# EasyEDA Pro project ProPrj_minibal.epro

# Schematic miniball
Board Name: miniball; Create Date: 2024-09-15; Page Name: P1; Project Name: miniball; Schematic Name: miniball; Update Date: 2024-09-29; Company: 嘉立创EDA; Page Size: A4; Version: V1.0
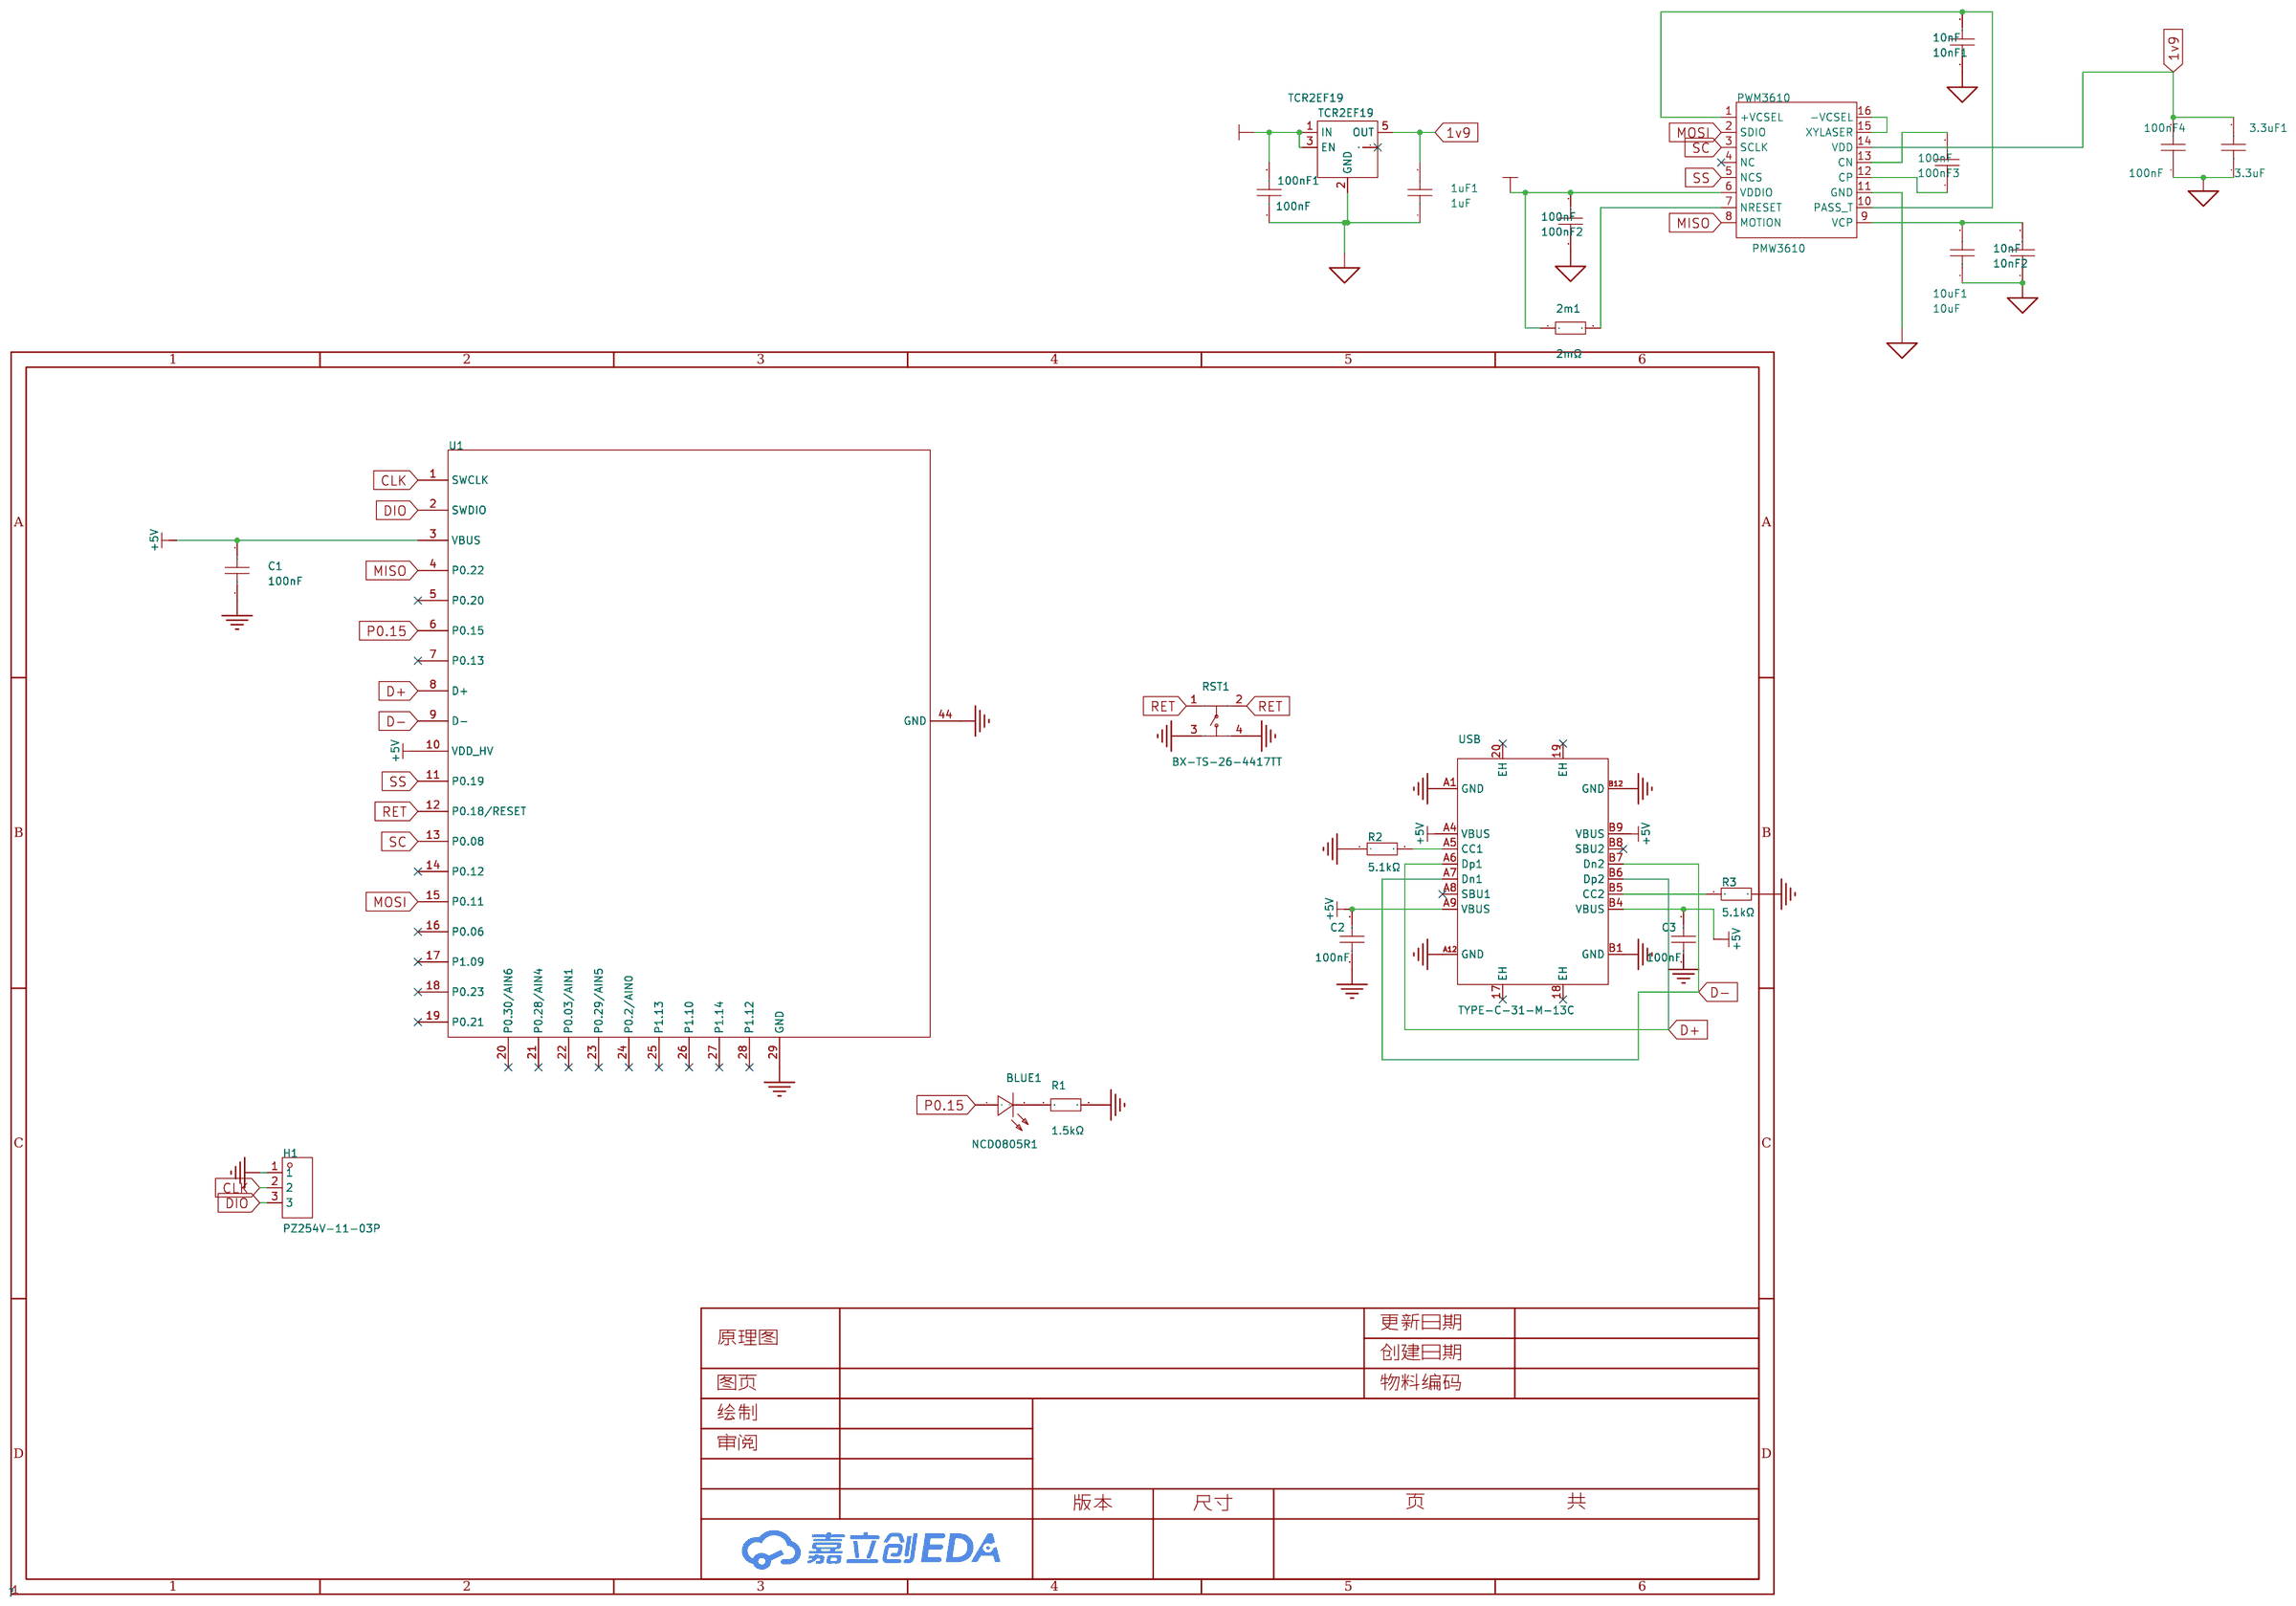
[diagram p0: schematic sheet]

## Parts
1uF1  1uF  [c0805]
2m1  2mΩ  [R0805]
3.3uF1  3.3uF  [c0805]
10nF1  10nF  [c0805]
10nF2  10nF  [c0805]
10uF1  10uF  [c0805]
100nF1  100nF  [c0805]
100nF2  100nF  [c0805]
100nF3  100nF  [c0805]
100nF4  100nF  [c0805]
BLUE1  NCD0805R1  [LED0805-R-RD]
C1  100nF  [C1206]
C2  100nF  [C0603]
C3  100nF  [C0603]
H1  PZ254V-11-03P  [HDR-TH_3P-P2.54-V-M]
PWM3610  PMW3610  [mylib:PMW3610]
R1  1.5kΩ  [R1206]
R2  5.1kΩ  [R0805]
R3  5.1kΩ  [R0805]
RST1  BX-TS-26-4417TT  [SW-SMD_4P-L5.2-W5.2-P3.70-LS6.5]
TCR2EF19  TCR2EF19  [Package_TO_SOT_SMD:SOT-23-5]
U1  N52840  [52840MICRO-v1]
USB  TYPE-C-31-M-13C  [USB-C-SMD_TYPE-C-31-M-13C]

## Library data of the parts
1uF1 = CL21B105KBFNNNE: 容值:1uF;精度:±10%;额定电压:50V;材质(温度系数):X7R;; LCSC Part Name: 1uF ±10% 50V; Supplier Part: C28323; Manufacturer: SAMSUNG(三星); Supplier Footprint: 0805; JLCPCB Part Class: Basic Part; Datasheet: https://atta.szlcsc.com/upload/public/pdf/source/20160218/1457707763339.pdf; Supplier: LCSC; Tolerance: ±10%; Voltage Rated: 50V; Temperature Coefficient: X7R
2m1 = RLM10FTSMR002: 阻值:2mΩ;精度:±1%;功率:500mW;温度系数:±50ppm/℃;; LCSC Part Name: 2mΩ ±1% 500mW; Supplier Part: C163090; Manufacturer: 大毅科技; Supplier Footprint: 0805; JLCPCB Part Class: Extended Part; Datasheet: https://atta.szlcsc.com/upload/public/pdf/source/20190621/C393099_0FB28B25F89EBDFD36A063D527AB5378.pdf; Supplier: LCSC; Tolerance: ±1%; Power(Watts): 500mW; Temperature Coefficient: ±50ppm/℃
3.3uF1 = 0805B335K160NT: 容值:3.3uF;精度:±10%;额定电压:16V;材质(温度系数):X7R;; LCSC Part Name: 3.3uF ±10% 16V; Supplier Part: C38332; Manufacturer: FH(风华); Supplier Footprint: 0805; JLCPCB Part Class: Extended Part; Datasheet: https://atta.szlcsc.com/upload/public/pdf/source/20200305/C486355_26A10D38EF8C2A5C37091D0039909270.pdf; Supplier: LCSC; Tolerance: ±10%; Voltage Rated: 16V; Temperature Coefficient: X7R
10nF1 10nF2 = CC0805KRX7R9BB103: 容值:10nF;精度:±10%;额定电压:50V;材质(温度系数):X7R;; LCSC Part Name: 10nF ±10% 50V; Supplier Part: C83170; Manufacturer: YAGEO(国巨); Supplier Footprint: 0805; JLCPCB Part Class: Extended Part; Datasheet: https://atta.szlcsc.com/upload/public/pdf/source/20170211/1486785656773.pdf; Supplier: LCSC; Tolerance: ±10%; Voltage Rated: 50V; Temperature Coefficient: X7R
10uF1 = CL21A106KOQNNNE: 容值:10uF;精度:±10%;额定电压:16V;材质(温度系数):X5R;; LCSC Part Name: 10uF ±10% 16V; Supplier Part: C1713; Manufacturer: SAMSUNG(三星); Supplier Footprint: 0805; JLCPCB Part Class: Extended Part; Datasheet: https://atta.szlcsc.com/upload/public/pdf/source/20160218/1457707763339.pdf; Supplier: LCSC; Tolerance: ±10%; Voltage Rated: 16V; Temperature Coefficient: X5R
100nF1-100nF4 = 0805B104K500NT: 容值:100nF;精度:±10%;额定电压:50V;材质(温度系数):X7R;; LCSC Part Name: 100nF ±10% 50V; Supplier Part: C38141; Manufacturer: FH(风华); Supplier Footprint: 0805; JLCPCB Part Class: Extended Part; Datasheet: https://atta.szlcsc.com/upload/public/pdf/source/20200305/C486355_26A10D38EF8C2A5C37091D0039909270.pdf; Supplier: LCSC; Tolerance: ±10%; Voltage Rated: 50V; Temperature Coefficient: X7R
BLUE1 = NCD0805R1: 灯头类型:-;发光颜色:红色;正向电压(VF):1.6V~2.6V;功率:65mW;正向电流:20mA;主波长:615nm~630nm;二极管配置:独立二极管;透镜颜色:无色透明透镜;色温:-;发光强度:67mcd~195mcd;发光角度:130°;载带方式:-;工作温度:-30℃~+85℃;; Supplier Part: C84256; Manufacturer: 国星光电; Supplier Footprint: 0805; JLCPCB Part Class: 基础库; Datasheet: https://atta.szlcsc.com/upload/public/pdf/source/20200820/C84256_F0A75A43B3EAD75808600A0514C76B99.pdf; Supplier: LCSC; Emitted Color: 红色; Forward Voltage (VF): 1.6V~2.6V; Power Dissipation: 65mW; Forward Current: 20mA; Dominant Wavelength: 615nm~630nm; Diode Configuration: 独立二极管; Lens Color: 无色透明透镜; Luminous Intensity: 67mcd~195mcd; Viewing Angle: 130°; Operating Temperature: -30℃~+85℃
C1 = CC0603KRX7R9BB104: 容值:100nF;精度:±10%;额定电压:50V;材质(温度系数):X7R;; LCSC Part Name: 100nF ±10% 50V; Supplier Part: C14663; Manufacturer: YAGEO(国巨); Supplier Footprint: 0603; JLCPCB Part Class: Basic Part; Datasheet: https://atta.szlcsc.com/upload/public/pdf/source/20180910/C282072_33301C7F631E79921B82A8DAC6BCC5B3.pdf; Supplier: LCSC; Tolerance: ±10%; Voltage Rated: 50V; Temperature Coefficient: X7R
C2 C3 = CAP_0603: Supplier Footprint: 0603
H1 = PZ254V-11-03P: 插针结构:1x3P;间距:2.54mm;行距:-;圆针/方针:方针;安装类型:直插;排数:单排;总PIN位数:3P;额定电流:3A;额定电压:250V;配合针长度:6mm;塑高:2.5mm;端接针长度:3mm;工作温度范围:-40℃~+105℃;颜色:黑色;; LCSC Part Name: 间距:2.54mm 1x3P 直插 方针; Supplier Part: C2937625; Manufacturer: XFCN(兴飞); Supplier Footprint: 插件,P=2.54mm; JLCPCB Part Class: Extended Part; Datasheet: https://atta.szlcsc.com/upload/public/pdf/source/20200309/C492402_8335C3D49C4E4C618838D59BB1D024C1.pdf; Supplier: LCSC; Pin Structure: 1x3P; Pitch: 2.54mm; Circluar Pins/Square Pins: 方针; Mounting Type: 直插; Number of Rows: 单排; Number of Pins: 3P; Current Rating (Max): 3A; Voltage Rating (Max): 250V; Length of Mating Pin: 6mm; Insulation Height: 2.5mm; Length of End Connection Pin: 3mm; Operating Temperature Range: -40℃~+105℃; Color: 黑色
PWM3610 = mysymbol_PMW3610
R1 = 0805W8F1501T5E: 电阻类型:厚膜电阻;阻值:1.5kΩ;精度:±1%;功率:125mW;最大工作电压:150V;温度系数:±100ppm/℃;; LCSC Part Name: 1.5kΩ ±1% 125mW 厚膜电阻; Supplier Part: C4310; Manufacturer: UNI-ROYAL(厚声); Supplier Footprint: 0805; JLCPCB Part Class: 基础库; Datasheet: https://atta.szlcsc.com/upload/public/pdf/source/20200306/C422600_1E6D84923E4A46A82E41ADD87F860B5C.pdf; Supplier: LCSC; Type: 厚膜电阻; Tolerance: ±1%; Power(Watts): 125mW; Overload Voltage (Max): 150V; Temperature Coefficient: ±100ppm/℃; Operating Temperature Range: -55℃~+155℃
R2 R3 = 0805W8F5101T5E: 电阻类型:厚膜电阻;阻值:5.1kΩ;精度:±1%;功率:125mW;最大工作电压:150V;温度系数:±100ppm/℃;; LCSC Part Name: 5.1kΩ ±1% 125mW 厚膜电阻; Supplier Part: C27834; Manufacturer: UNI-ROYAL(厚声); Supplier Footprint: 0805; JLCPCB Part Class: 基础库; Datasheet: https://atta.szlcsc.com/upload/public/pdf/source/20200306/C422600_1E6D84923E4A46A82E41ADD87F860B5C.pdf; Supplier: LCSC; Type: 厚膜电阻; Tolerance: ±1%; Power(Watts): 125mW; Overload Voltage (Max): 150V; Temperature Coefficient: ±100ppm/℃; Operating Temperature Range: -55℃~+155℃
RST1 = BX-TS-26-4417TT: 电路结构:单刀单掷;按钮形状:圆形按钮;作用力:260gf;安装方式:立贴;开关长度:4mm;开关宽度:4mm;开关高度:1.7mm;带支架:不带;触点电流:50mA;额定电压(AC):250V;额定电压(DC):12V;绝缘电阻:100MΩ;机械寿命:10万次;; LCSC Part Name: 4x4x1.7铜头开关; Supplier Part: C18078110; Manufacturer: Bossie(博锡); Supplier Footprint: SMD-4P,4x4mm; Datasheet: https://atta.szlcsc.com/upload/public/pdf/source/20231017/916BF7A8DB1936A62562F9A253B59526.pdf; Supplier: LCSC; Circuit: 单刀单掷; Actuator Style: 圆形按钮; Operating Force: 260gf; Mounting Style: 立贴; Switch Length: 4mm; Switch Width: 4mm; Switch Height: 1.7mm; Strike Gundam: 不带; Contact Current: 50mA; Voltage Rating (AC): 250V; Voltage Rating (DC): 12V; Insulation Resistance: 100MΩ; Actuator/Cap Color: 金色; Pin Style: 鸥翼型; Mechanical Life: 10万次; Operating Temperature: -30℃~+80℃
TCR2EF19 = Regulator_Linear_TLV70218_SOT23-5: LCSC: C146366
U1 = 52840micro_v1
USB = TYPE-C-31-M-13C: 连接器类型:Type-C;标准:-;公母:母;端口数量:1;触点数量:16P;安装方式:沉板;额定电流 - 电源:5A;工作温度范围:-30℃~+80℃;; LCSC Part Name: Type-C 母 沉板; Supplier Part: C2848620; Manufacturer: 韩国韩荣; Supplier Footprint: SMD; JLCPCB Part Class: 扩展库; Datasheet: https://atta.szlcsc.com/upload/public/pdf/source/20210810/4CCDF598433BF097AC090909194D2506.pdf; Supplier: LCSC; Connector Type: Type-C; Gender: 母; Number of Ports: 1; Number of Contacts: 16P; Mounting Style: 沉板; Current Rating - Power (Max): 5A; Operating Temperature Range: -30℃~+80℃

## Nets
1v9: 1uF1.2 3.3uF1.2 100nF4.2 PWM3610.14(VDD) TCR2EF19.5(OUT)
+5V: C1.2 C2.2 C3.2 U1.3(VBUS) U1.10(VDD_HV) USB.A4(VBUS) USB.A9(VBUS) USB.B4(VBUS) USB.B9(VBUS)
GND: 1uF1.1 3.3uF1.1 10nF1.1 10nF2.1 10uF1.1 100nF1.1 100nF2.1 100nF4.1 C1.1 C2.1 C3.1 H1.1 PWM3610.11(GND) R1.2 R2.1 R3.2 RST1.3 RST1.4 TCR2EF19.2(GND) U1.29(GND) U1.44(GND) USB.A1(GND) USB.A12(GND) USB.B1(GND) USB.B12(GND)
VCC_EXT: 2m1.1 100nF1.2 100nF2.2 PWM3610.6(VDDIO) TCR2EF19.1(IN) TCR2EF19.3(EN)
CLK: H1.2 U1.1(SWCLK)
D+: U1.8(D+) USB.A6(Dp1) USB.B6(Dp2)
D-: U1.9(D-) USB.A7(Dn1) USB.B7(Dn2)
DIO: H1.3 U1.2(SWDIO)
MISO: PWM3610.8(MOTION) U1.4(P0.22)
MOSI: PWM3610.2(SDIO) U1.15(P0.11)
P0.15: BLUE1.1(+) U1.6(P0.15)
RET: RST1.1 RST1.2 U1.12(P0.18/RESET)
SC: PWM3610.3(SCLK) U1.13(P0.08)
SS: PWM3610.5(NCS) U1.11(P0.19)
$1N774: BLUE1.2(-) R1.1
$1N1429: 2m1.2 PWM3610.7(NRESET)
$1N1432: 10nF2.2 10uF1.2 PWM3610.9(VCP)
$1N1434: 10nF1.2 PWM3610.1(+VCSEL) PWM3610.10(PASS_T)
$1N1436: PWM3610.15(XYLASER) PWM3610.16(-VCSEL)
$1N1437: 100nF3.2 PWM3610.13(CN)
$1N1438: 100nF3.1 PWM3610.12(CP)
$1N2733: R3.1 USB.B5(CC2)
$1N2744: R2.2 USB.A5(CC1)

Not connected (* = marked no-connect by the designer): PWM3610 4(NC)*; TCR2EF19 4(NC)*; U1 5(P0.20)* 7(P0.13)* 14(P0.12)* 16(P0.06)* 17(P1.09)* 18(P0.23)* 19(P0.21)* 20(P0.30/AIN6)* 21(P0.28/AIN4)* 22(P0.03/AIN1)* 23(P0.29/AIN5)* 24(P0.2/AIN0)* 25(P1.13)* 26(P1.10)* 27(P1.14)* 28(P1.12)*; USB 17(EH)* 18(EH)* 19(EH)* 20(EH)* A8(SBU1)* B8(SBU2)*

# Board miniball
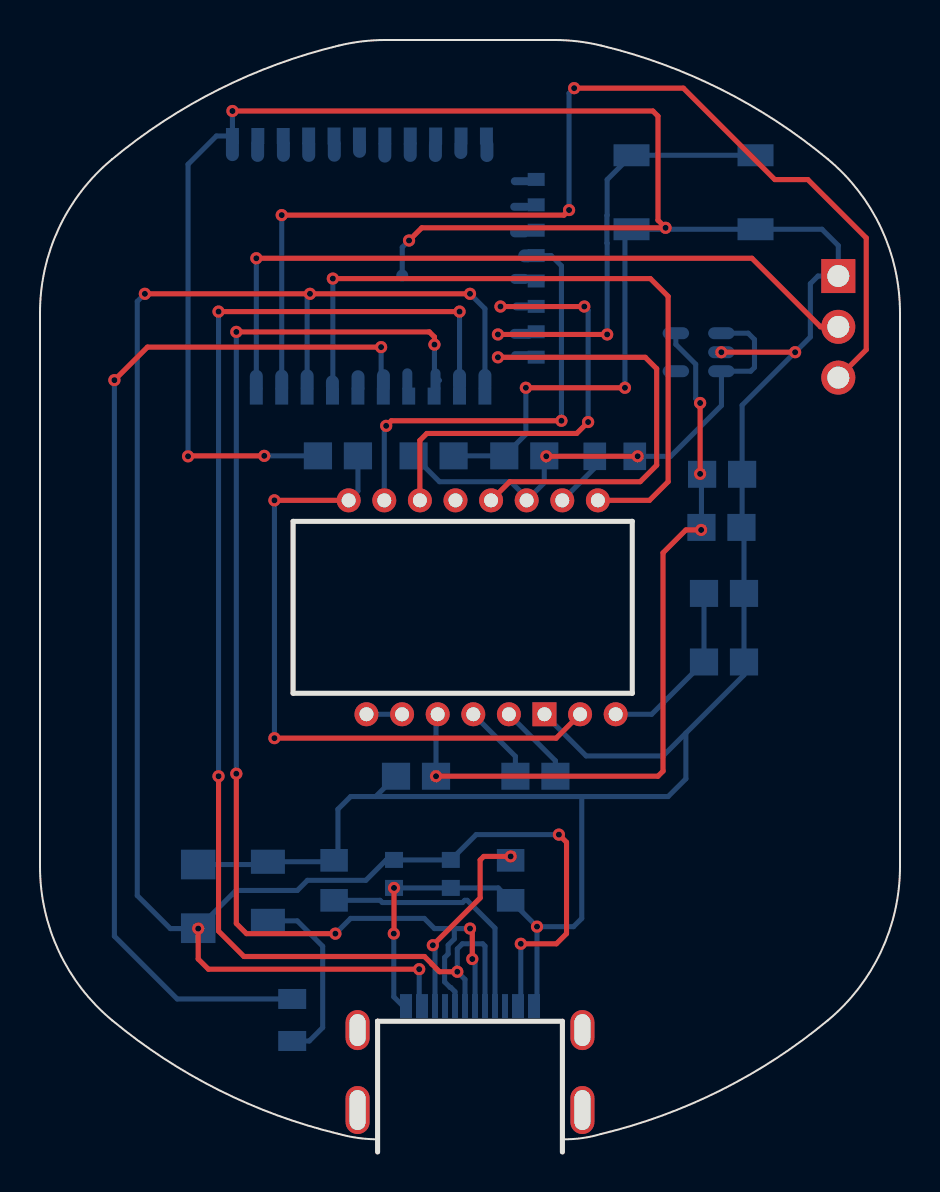
[diagram p1: board, top side]
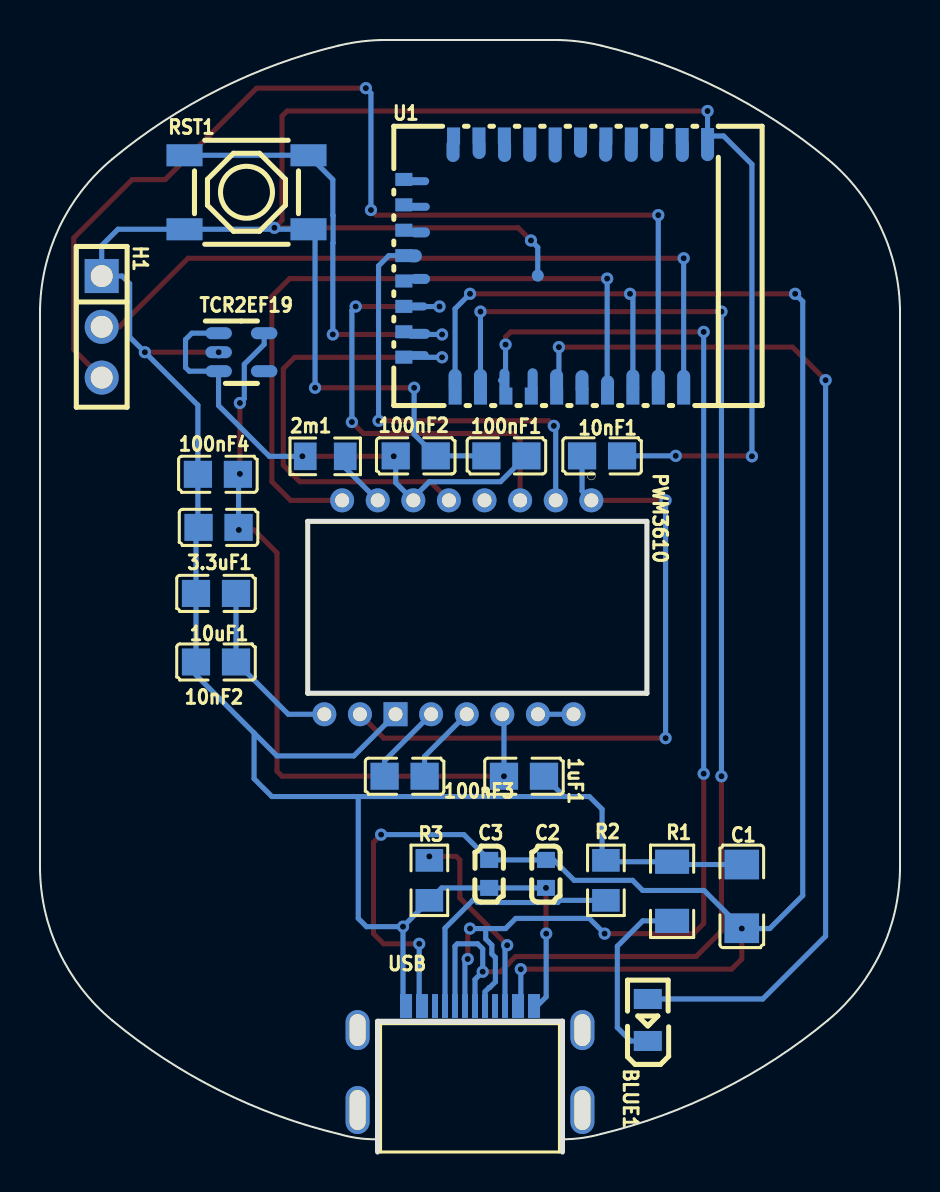
[diagram p2: board, bottom side, seen from below]

Outline 43 x 55.62 mm; copper layers: Top Layer, Bottom Layer. Coordinates in mm from the lower left corner of the outline.
Outline path: 16.93,0.64 arc(15.93,0.7) 14.95,0.9 arc(8.95,3.09) 3.61,6.58 arc(0.95,10.03) 0,14.28 0,41.97 arc(0.95,46.22) 3.61,49.66 arc(8.95,53.15) 14.95,55.35 arc(16.11,55.55) 17.29,55.62 25.71,55.62 arc(26.89,55.55) 28.05,55.35 arc(34.05,53.15) 39.39,49.66 arc(42.05,46.22) 43,41.97 43,14.28 arc(42.05,10.03) 39.39,6.58 arc(34.05,3.09) 28.05,0.9 arc(27.14,0.7) 26.2,0.64
Stack: Top Layer 0.035mm / Dielectric1 1.51mm FR4 er 4.5 / Bottom Layer 0.035mm

## Design rules (mm)
template: 自定义配置
spacing copperThickness1oz: track to track 0.102, other pairs 0.152 to 0.3
spacing customer_rule (default): track to track 0.203, other pairs 0.203 to 0.203
track width copperThickness1oz: min 0.127, default 0.254, max 2.54
track width copperThickness2oz: min 0.203, default 0.254, max 2.54
track width custom_style (default): min 0.254, default 0.254, max 0.762
track width vcc_gnd: min 0.254, default 0.762, max 0.762
differential pair differentialPair (default): width min 0.127, default 0.254, max 2.54; gap min 0.152, default 0.152
via viaSize (default): diameter min 0.5, default 0.61, max 10; hole min 0.3, default 0.305, max 6.299
net 1V9 uses vcc_gnd
net GND uses vcc_gnd
net VCC_EXT uses vcc_gnd
net +5V uses vcc_gnd

## Placement (name value [footprint] x y rotation side)
1uF1  1uF  [c0805]  18.8 18.8 0 bottom
2m1  2mΩ  [R0805]  28.74 34.8 180 bottom
3.3uF1  3.3uF  [c0805]  34.07 31.24 180 bottom
10nF1  10nF  [c0805]  14.9 34.82 0 bottom
10nF2  10nF  [c0805]  34.2 24.51 180 bottom
10uF1  10uF  [c0805]  34.2 27.94 180 bottom
100nF1  100nF  [c0805]  19.68 34.82 180 bottom
100nF2  100nF  [c0805]  24.21 34.82 0 bottom
100nF3  100nF  [c0805]  24.77 18.8 180 bottom
100nF4  100nF  [c0805]  34.11 33.9 180 bottom
BLUE1  NCD0805R1  [LED0805-R-RD]  12.61 6.61 90 bottom
C1  100nF  [C1206]  7.91 12.79 270 bottom
C2  100nF  [C0603]  17.7 13.91 90 bottom
C3  100nF  [C0603]  20.54 13.91 90 bottom
H1  PZ254V-11-03P  [HDR-TH_3P-P2.54-V-M]  39.91 41.28 270 bottom
PWM3610  PMW3610  [mylib:PMW3610]  15.43 32.6 270 bottom
R1  1.5kΩ  [R1206]  11.4 13.04 90 bottom
R2  5.1kΩ  [R0805]  14.7 13.59 270 bottom
R3  5.1kΩ  [R0805]  23.53 13.59 270 bottom
RST1  BX-TS-26-4417TT  [SW-SMD_4P-L5.2-W5.2-P3.70-LS6.5]  32.68 48.01 180 bottom
TCR2EF19  TCR2EF19  [Package_TO_SOT_SMD:SOT-23-5]  32.93 40.01 180 bottom
U1  N52840  [52840MICRO-v1]  25.31 37.47 180 bottom
USB  TYPE-C-31-M-13C  [USB-C-SMD_TYPE-C-31-M-13C]  21.5 4.7 180 bottom

## Footprints (pads in the part's own frame, mm; a bottom-side part is the same pattern mirrored in y, then rotated)
52840MICRO-v1
  oval 0.65x1.2 smd: 1(14.493,1.065) 2(13.223,1.07) 3(11.954,1.085) 5(9.409,1.04) 6(8.139,1.095) 9(4.333,1.109) 10(3.063,1.109) 19(2.963,12.655) 21(5.538,12.655) 22(6.798,12.66) 23(8.069,12.625) 25(10.594,12.67) 26(11.873,12.66) 27(13.139,12.665) 28(14.428,12.66) 29(15.688,12.7)
  rect 0.65x0.85 smd: 1(14.495,0.346) 2(13.225,0.346) 3(11.955,0.346) 4(10.685,0.346) 5(9.415,0.346) 6(8.145,0.346) 7(6.875,0.346) 8(5.605,0.346) 9(4.335,0.346) 10(3.065,0.346) 19(2.988,13.355) 20(4.258,13.355) 21(5.528,13.355) 22(6.798,13.355) 23(8.068,13.355) 24(9.338,13.355) 25(10.608,13.355) 26(11.878,13.355)
  oval 0.65x0.9 smd: 4(10.688,0.934)
  oval 0.5x1.2 smd: 7(6.944,1.135) 8(5.534,1.13)
  rect 0.85x0.65 smd: 11(0.501,2.293) 12(0.501,3.563) 13(0.501,4.833) 14(0.501,6.103) 15(0.501,7.373) 16(0.501,8.643) 17(0.501,9.913) 18(0.501,11.183)
  oval 1x0.4 smd: 11(1.248,2.394) 17(1.298,9.815) 18(1.268,11.095)
  oval 1.2x0.5 smd: 12(1.228,3.459)
  oval 0.9x0.4 smd: 13(1.239,4.83)
  oval 1x0.5 smd: 14(1.308,6.205) 16(1.308,8.534)
  oval 0.8x0.65 smd: 15(1.004,7.359)
  oval 0.65x1 smd: 20(4.269,12.705) 24(9.334,12.765)
  rect 0.65x0.8 smd: 27(13.148,13.355) 28(14.418,13.355) 29(15.688,13.355)
  round 0.6 smd: 44(7.199,6.375)
C0603
  rect 0.8x0.9 smd: 1(-0.7,0) 2(0.7,0)
c0805
  rect 1.41x1.35 smd: 1(-1,0) 2(1,0)
C1206
  rect 1.485x1.728 smd: 1(-1.593,0) 2(1.593,0)
HDR-TH_3P-P2.54-V-M
  rect 1.7x1.7 hole 1.1: 1(-2.54,0)
  round 1.7 hole 1.1: 2(0,0) 3(2.54,0)
LED0805-R-RD
  rect 1x1.399 smd: 1(1.05,0) 2(-1.05,0)
mylib:PMW3610
  round 1.2 hole 0.7: 1(0,0) 2(0,-1.78) 3(0,-3.56) 4(0,-5.34) 5(0,-7.12) 6(0,-8.9) 7(0,-10.68) 8(0,-12.46) 9(10.7,-13.35) 10(10.7,-11.57) 12(10.7,-8.01) 13(10.7,-6.23) 14(10.7,-4.45) 15(10.7,-2.67) 16(10.7,-0.89)
  rect 1.2x1.2 hole 0.7: 11(10.7,-9.79)
Package_TO_SOT_SMD:SOT-23-5
  rrect 1.325x0.6 smd: 1(-1.137,0.95) 2(-1.137,0) 3(-1.137,-0.95) 4(1.137,-0.95) 5(1.137,0.95)
R0805
  rect 1.133x1.377 smd: 1(-1,0) 2(1,0)
R1206
  rect 1.208x1.701 smd: 1(-1.479,0) 2(1.479,0)
SW-SMD_4P-L5.2-W5.2-P3.70-LS6.5
  rect 1.8x1.1 smd: 1(-3.1,1.85) 2(3.1,1.85) 3(-3.1,-1.85) 4(3.1,-1.85)
USB-C-SMD_TYPE-C-31-M-13C
  oval 1.2x2 hole 0.8x1.6: 17(5.62,1.4) 20(-5.62,1.4)
  oval 1.2x2.4 hole 0.8x2: 18(5.62,-2.6) 19(-5.62,-2.6)
  rect 0.3x1.2 smd: A1(-3.35,2.6) A4(-2.55,2.6) A5(-1.25,2.6) A6(-0.25,2.6) A7(0.25,2.6) A8(1.25,2.6) A9(2.55,2.6) A12(3.35,2.6) B1(3.05,2.6) B4(2.25,2.6) B5(1.75,2.6) B6(0.75,2.6) B7(-0.75,2.6) B8(-1.75,2.6) B9(-2.25,2.6) B12(-3.05,2.6)

## Nets
As in the schematic, except:
1V9: 1uF1.2 3.3uF1.2 100nF4.2 PWM3610.14 TCR2EF19.5

Pads without a net: PWM3610 4; TCR2EF19 4; U1 5 7 14 16 17 18 19 20 21 22 23 24 25 26 27 28; USB 17 18 19 20 A8 B8

## Via types
v1: diameter 0.61, hole 0.305, Top Layer to Bottom Layer, 54 vias

## Routing (per net, layer and track width the routed paths; a pad name or vN(x,y) marks a point on that pad's centre or on a via; arc(x,y) is an arc through that point)
1V9: length 38.2
  Top Layer w0.254: v1(19.8,18.8) 30.9,18.8 31.15,19.05 31.15,29.97 32.29,31.12 v1(33.06,31.12) ; v1(33.01,33.92) v1(33.01,37.47)
  Bottom Layer w0.254: 100nF4.2 33.07,33.87 3.3uF1.2 33.07,31.13 v1(33.06,31.12) ; v1(33.01,37.47) 32.78,37.69 32.78,39.41 31.79,40.4 TCR2EF19.5 ; PWM3610.14 19.8,21.81 v1(19.8,18.8)
+5V: length 105.3
  Top Layer w0.254: v1(5.24,42.93) v1(13.5,42.93) v1(21.5,42.93) ; v1(24.04,10.42) 25.82,10.42 26.33,10.92 26.33,15.5 v1(25.94,15.88) ; v1(7.91,11.18) 7.91,9.65 8.42,9.14 v1(18.96,9.14)
  Bottom Layer w0.254: v1(5.24,42.93) 4.86,42.55 4.86,12.83 6.51,11.18 7.89,11.18 C1.2 ; v1(21.5,42.93) 22.25,42.18 U1.10 ; USB.B4 USB.A9 18.96,7.31 v1(18.96,9.14) ; v1(13.5,42.93) 13.36,42.78 U1.3 ; C1.2 v1(7.91,11.18) ; C1.2 9.8,13.08 12.86,13.08 13.37,13.59 16.29,13.59 17.31,14.61 C2.2 C3.2 21.81,15.88 v1(25.94,15.88) ; v1(24.04,10.42) 24.04,7.31 24.05,7.3 USB.B9
GND: length 196.1
  Top Layer w0.254: v1(18.45,45.59) 19.09,46.23 v1(31.28,46.23) 30.9,46.61 30.9,51.82 30.64,52.07 v1(9.62,52.07) ; v1(24.29,38.23) v1(29.25,38.23) ; v1(11.21,34.82) 7.43,34.82 v1(7.4,34.8) ; v1(17.7,13.21) 17.7,10.93 v1(17.69,10.92) ; v1(34.07,40.01) v1(37.76,40.01)
  Bottom Layer w0.254: v1(24.85,11.27) USB.A1 24.55,7.3 ; v1(24.85,11.27) 26.67,11.27 27.09,11.69 27.09,17.77 27.1,17.78 ; v1(24.85,11.27) R3.2 22.91,13.21 C3.1 v1(17.7,13.21) ; v1(29.25,38.23) 29.25,45.83 RST1.4 RST1.3 39.1,46.16 39.91,45.34 H1.1 38.9,43.82 38.52,43.44 38.52,40.77 v1(37.76,40.01) 35.11,37.36 100nF4.1 35.11,31.28 3.3uF1.1 35.2,31.12 10uF1.1 10nF2.1 35.2,23.86 32.29,20.96 ; v1(9.62,52.07) 9.62,50.82 8.82,50.82 7.4,49.4 v1(7.4,34.8) ; v1(17.69,10.92) 17.69,7.76 18.15,7.3 USB.B1 ; 32.29,20.96 32.29,18.67 31.41,17.78 27.1,17.78 ; 32.29,20.96 31.15,19.81 27.31,19.81 PWM3610.11 ; 16.78,17.78 15.53,17.78 14.9,17.15 14.9,14.78 R2.1 14.63,14.52 R1.2 11.26,14.38 C1.1 ; 16.78,17.78 27.1,17.78 ; 16.78,17.78 1uF1.1 ; U1.44 18.11,45.25 v1(18.45,45.59) ; 10nF1.1 v1(11.21,34.82) ; 100nF1.1 100nF2.1 24.29,35.9 v1(24.29,38.23)
VCC_EXT: length 25.8
  Top Layer w0.254: v1(25.31,34.8) v1(29.88,34.8)
  Bottom Layer w0.254: 29.88,34.8 31.53,34.8 34.07,37.34 34.07,39.05 TCR2EF19.3 35.54,39.06 35.72,39.24 35.72,40.64 35.41,40.96 TCR2EF19.1 ; 29.88,34.8 2m1.1 ; 29.88,34.8 v1(29.88,34.8) ; 100nF1.2 19.97,33.53 23.53,33.53 24.33,32.73 PWM3610.6 25.21,33.48 100nF2.2
CLK: length 36.7
  Top Layer w0.254: v1(10.82,44.7) 35.6,44.7 39.03,41.28 H1.2
  Bottom Layer w0.254: U1.1 v1(10.82,44.7)
D+: length 62.5
  Top Layer w0.254: v1(9.82,41.02) 19.47,41.02 19.72,40.77 v1(19.72,40.39) ; v1(9.82,18.92) 9.82,11.43 10.32,10.92 v1(14.77,10.92) ; v1(21.5,11.18) 21.61,11.06 v1(21.61,9.65)
  Bottom Layer w0.254: 20.72,11.18 20.72,10.66 20.41,10.35 20.41,9.91 20.23,9.73 20.23,8.51 20.51,8.23 20.54,8.23 20.75,8.02 USB.B6 ; 20.72,11.18 19.72,11.18 19.21,11.69 15.53,11.69 v1(14.77,10.92) ; 20.72,11.18 v1(21.5,11.18) ; v1(9.82,18.92) v1(9.82,41.02) ; v1(19.72,40.39) 19.72,38.85 19.98,38.6 ; USB.A6 21.75,7.3 21.75,9.65
D-: length 66.8
  Top Layer w0.254: v1(20.86,9.02) 19.98,9.02 19.59,9.4 19.59,9.41 19.22,9.78 10.2,9.78 8.93,11.05 v1(8.93,18.8) ; v1(20.98,42.04) v1(8.93,42.04)
  Bottom Layer w0.254: USB.A7 21.25,8.63 v1(20.86,9.02) 20.86,10.16 21.12,10.42 22.13,10.42 22.25,10.3 USB.B7 ; v1(8.93,42.04) v1(8.93,18.8) ; U1.9 v1(20.98,42.04)
DIO: length 54.3
  Top Layer w0.254: 39.91,38.74 41.31,40.13 41.31,45.72 38.39,48.64 36.74,48.64 32.17,53.21 v1(26.71,53.21) ; v1(26.45,47.12) 26.2,46.86 v1(12.09,46.86)
  Bottom Layer w0.254: v1(26.71,53.21) 26.45,52.96 v1(26.45,47.12) ; U1.2 v1(12.09,46.86)
MISO: length 35.6
  Top Layer w0.254: 27.89,32.6 30.47,32.6 31.41,33.53 31.41,42.8 30.52,43.69 v1(14.64,43.69)
  Bottom Layer w0.254: U1.4 14.64,38.42 v1(14.64,43.69)
MOSI: length 21.9
  Top Layer w0.254: v1(17.31,36.32) 17.56,36.58 v1(26.07,36.58)
  Bottom Layer w0.254: v1(17.31,36.32) 17.21,36.23 PWM3610.2 ; U1.15 25.56,44.84 26.07,44.32 v1(26.07,36.58)
P0.15: length 53.8
  Top Layer w0.254: v1(3.72,38.61) 5.37,40.26 v1(17.05,40.26)
  Bottom Layer w0.254: v1(17.05,40.26) 17.05,38.68 U1.6 ; BLUE1.1 6.86,7.66 3.72,10.8 v1(3.72,38.61)
RET: length 23.1
  Top Layer w0.254: v1(22.9,40.89) v1(28.36,40.89)
  Bottom Layer w0.254: v1(28.36,40.89) 28.36,45.46 28.35,45.47 28.35,46.84 28.36,46.86 28.36,48.64 RST1.2 RST1.1 ; v1(22.9,40.89) 24.67,40.89 U1.12
SC: length 22.9
  Top Layer w0.254: v1(27.41,36.51) 26.83,35.94 19.34,35.94 18.99,35.59 PWM3610.3 ; v1(27.22,42.29) v1(23.02,42.29)
  Bottom Layer w0.254: v1(27.22,42.29) 27.41,42.1 v1(27.41,36.51) ; U1.13 24.07,42.29 v1(23.02,42.29)
SS: length 23.9
  Top Layer w0.254: v1(22.9,39.75) 30.26,39.75 30.83,39.18 30.83,34.35 30.01,33.53 23.49,33.53 PWM3610.5
  Bottom Layer w0.254: v1(22.9,39.75) 24.8,39.75 U1.11
$1N774: length 9.1
  Bottom Layer w0.254: R1.1 12.86,11.56 14.13,10.29 14.13,6.22 13.46,5.55 BLUE1.2
$1N1429: length 2.9
  Bottom Layer w0.254: 2m1.2 27.74,34.22 PWM3610.7
$1N1432: length 8.9
  Bottom Layer w0.254: PWM3610.9 30.58,21.9 10nF2.2 10uF1.2
$1N1434: length 33.8
  Top Layer w0.254: PWM3610.10 25.81,20.7 v1(11.72,20.7) ; PWM3610.1 v1(11.72,32.6)
  Bottom Layer w0.254: PWM3610.1 15.9,33.06 10nF1.2 ; v1(11.72,32.6) v1(11.72,20.7)
$1N1436: length 1.8
  Bottom Layer w0.254: PWM3610.16 PWM3610.15
$1N1437: length 4
  Bottom Layer w0.254: PWM3610.13 23.77,19.79 100nF3.2
$1N1438: length 4.1
  Bottom Layer w0.254: PWM3610.12 25.77,19.57 100nF3.1
$1N2733: length 10.1
  Top Layer w0.254: v1(23.53,14.79) 22.19,14.79 22.01,14.61 22.01,12.71 v1(19.64,10.34)
  Bottom Layer w0.254: v1(19.64,10.34) 19.75,10.24 USB.B5 ; v1(23.53,14.79) R3.1
$1N2744: length 12.6
  Bottom Layer w0.254: R2.2 17,12.59 17.11,12.48 21.13,12.48 21.24,12.59 21.36,12.59 22.75,11.2 USB.A5

## Copper pours and planes (outline as drawn; the poured copper is in the pictures)
GND on Top Layer: -1.74,56.39 44.36,56.39 44.36,-4.7 -1.74,-4.7
GND on Bottom Layer: -1.87,56.64 44.23,56.64 44.23,-4.95 -1.87,-4.95

## Text on the board
Top Layer: 标题 | 单位 | 比例 | 投影角度 | 上一次更新 | 大小 | 图纸 | PCB | 毫米 | 1:1 | 09/15/24 | A3 | 1/1 | A | B | C | D | E | F | 1 | 2 | 3 | 4 | 5 | 6 | 7 | 8
